# Altium schematic sheet Top-level.SchDoc: nRF54L15 miniDevKit
size A4; DrawnBy: Vamsi Krishna Sesham; Revision: v1.0; SheetNumber: 1; SheetTotal: 6
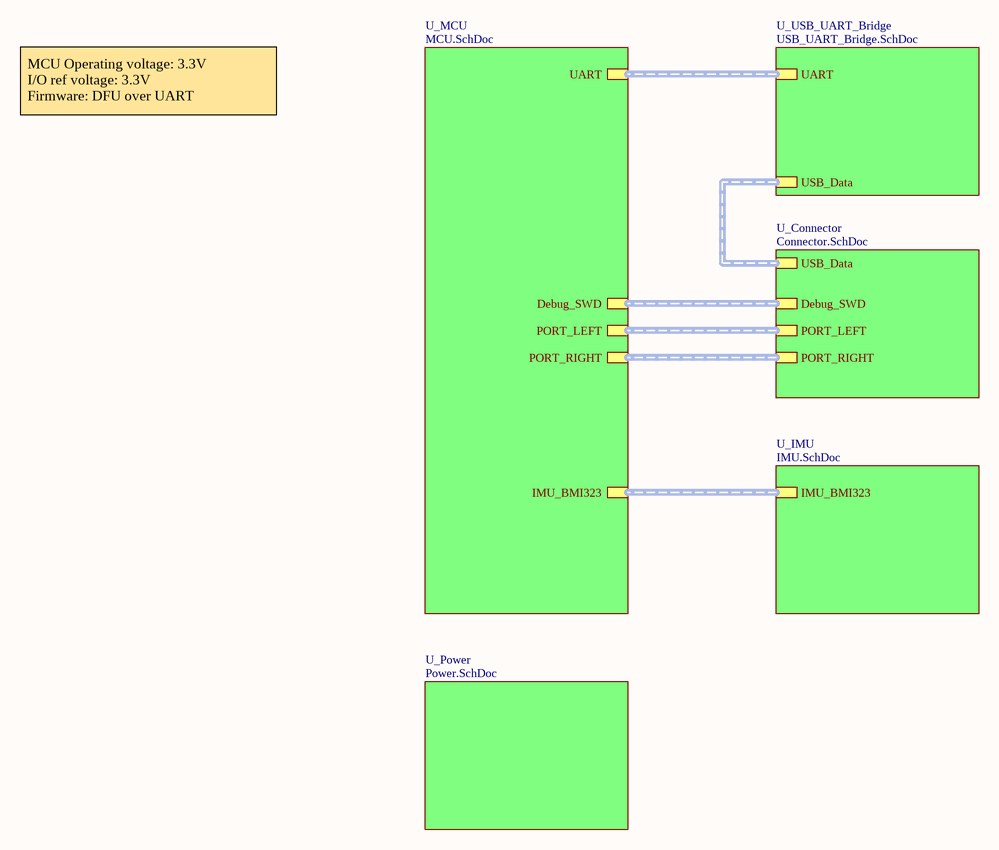
[diagram p0: Top-level.SchDoc]

## Sub-sheets
U_Connector = Connector.SchDoc: USB_Data (harness USB), Debug_SWD (harness SWD), PORT_LEFT (harness Conn_R), PORT_RIGHT (harness Conn_L)
U_IMU = IMU.SchDoc: IMU_BMI323 (harness IMU)
U_MCU = MCU.SchDoc: UART (harness USB_UART), IMU_BMI323 (harness IMU), Debug_SWD (harness SWD), PORT_LEFT (harness Conn_R), PORT_RIGHT (harness Conn_L)
U_Power = Power.SchDoc: no entries
U_USB_UART_Bridge = USB_UART_Bridge.SchDoc: USB_Data (harness USB), UART (harness USB_UART)

## Buses and harness runs
harness sheet U_Connector/Debug_SWD = sheet U_MCU/Debug_SWD
harness sheet U_Connector/PORT_LEFT = sheet U_MCU/PORT_LEFT
harness sheet U_Connector/PORT_RIGHT = sheet U_MCU/PORT_RIGHT
harness sheet U_Connector/USB_Data = sheet U_USB_UART_Bridge/USB_Data
harness sheet U_IMU/IMU_BMI323 = sheet U_MCU/IMU_BMI323
harness sheet U_MCU/UART = sheet U_USB_UART_Bridge/UART

## Notes on the sheet
- MCU Operating voltage: 3.3V
  I/O ref voltage: 3.3V
  Firmware: DFU over UART